# Altium schematic sheet MCU.SchDoc
size A4
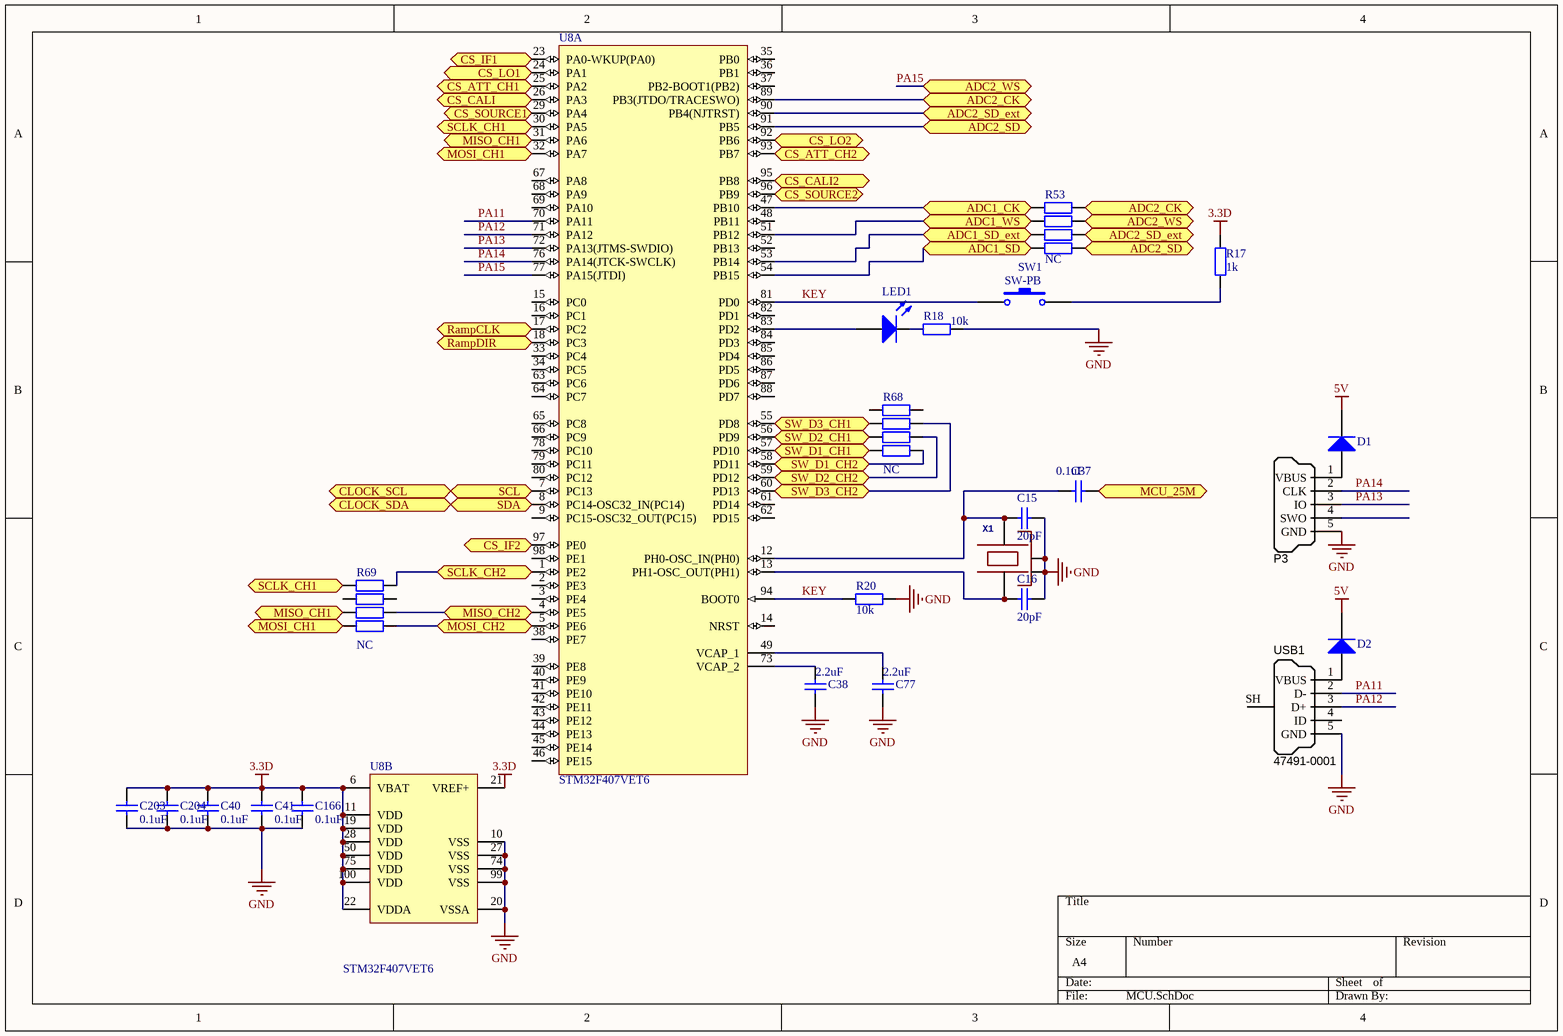
[diagram p0: MCU.SchDoc]

## Parts
C15  value 20pF  [0402]  (hidden comment: Cap)
C16  value 20pF  [0402]  (hidden comment: Cap)
C37  0.1uF  [0402]
C38  2.2uF  [0603]
C40  value 0.1uF  [0402]  (hidden comment: Cap)
C41  value 0.1uF  [0402]  (hidden comment: Cap)
C77  2.2uF  [0603]
C166  value 0.1uF  [0402]  (hidden comment: Cap)
C203  value 0.1uF  [0402]  (hidden comment: Cap)
C204  value 0.1uF  [0402]  (hidden comment: Cap)
D1  (no value)  [LC-SOD-323]
D2  (no value)  [LC-SOD-323]
LED1  LED0  [0603]  (value not drawn)
P3  SWD_MicroUSB  [MICRO-YZX]  (value not drawn)
R17  1k  [0402]
R18  10k  [0402]
R20  value 10k  [0402]  (hidden comment: Res2)
R53  NC  [0402X4]
R68  NC  [0402X4]
R69  NC  [0402X4]
SW1  SW-PB  [SW3x4]
U8  STM32F407VET6  [STM-LQFP100_N]  (parts A,B of 2)
USB1  Manufacturer Part Number 1: 47491-0001  [MICRO-YZX]  (hidden comment: USB Micro Type B)
X1  24.000 KHz 3.2x2.5mm 8-10pf  [OSCILLATOR-2.5x2.0]  (value not drawn)

## Ports
ADC1_CK, ADC1_SD, ADC1_SD_ext, ADC1_WS, ADC2_CK, ADC2_SD, ADC2_SD_ext, ADC2_WS, CLOCK_SCL, CLOCK_SDA, CS_ATT_CH1, CS_ATT_CH2, CS_CALI, CS_CALI2, CS_IF1, CS_IF2, CS_LO1, CS_LO2, CS_SOURCE1, CS_SOURCE2, MCU_25M, MISO_CH1, MISO_CH2, MOSI_CH1, MOSI_CH2, RampCLK, RampDIR, SCL, SCLK_CH1, SCLK_CH2, SDA, SW_D1_CH1, SW_D1_CH2, SW_D2_CH1, SW_D2_CH2, SW_D3_CH1, SW_D3_CH2

## Nets
3.3D: C40.2 C41.2 C166.2 C203.2 C204.2 R17.2 U8.6(VBAT) U8.11(VDD) U8.19(VDD) U8.21(VREF+) U8.22(VDDA) U8.28(VDD) U8.50(VDD) U8.75(VDD) U8.100(VDD)
5V: D1.2(K) D2.2(K)
GND: C15.1 C16.1 C38.1 C40.1 C41.1 C77.1 C166.1 C203.1 C204.1 P3.5(GND) R18.2 R20.2 U8.10(VSS) U8.20(VSSA) U8.27(VSS) U8.74(VSS) U8.99(VSS) USB1.5(GND) X1.2(NC_2) X1.4(NC_4)
ADC1_CK: R53.1 U8.47(PB10) ; port ADC1_CK
ADC1_SD: R53.4 U8.54(PB15) ; port ADC1_SD
ADC1_SD_ext: R53.3 U8.53(PB14) ; port ADC1_SD_ext
ADC1_WS: R53.2 U8.51(PB12) ; port ADC1_WS
ADC2_CK: R53.8 U8.89(PB3(JTDO/TRACESWO)) ; port ADC2_CK
ADC2_SD: R53.5 U8.91(PB5) ; port ADC2_SD
ADC2_SD_ext: R53.6 U8.90(PB4(NJTRST)) ; port ADC2_SD_ext
CLOCK_SCL: U8.7(PC13) ; port SCL, port CLOCK_SCL
CLOCK_SDA: U8.8(PC14-OSC32_IN(PC14)) ; port SDA, port CLOCK_SDA
CS_ATT_CH1: U8.25(PA2) ; port CS_ATT_CH1
CS_ATT_CH2: U8.93(PB7) ; port CS_ATT_CH2
CS_CALI: U8.26(PA3) ; port CS_CALI
CS_CALI2: U8.95(PB8) ; port CS_CALI2
CS_IF1: U8.23(PA0-WKUP(PA0)) ; port CS_IF1
CS_IF2: U8.97(PE0) ; port CS_IF2
CS_LO1: U8.24(PA1) ; port CS_LO1
CS_LO2: U8.92(PB6) ; port CS_LO2
CS_SOURCE1: U8.29(PA4) ; port CS_SOURCE1
CS_SOURCE2: U8.96(PB9) ; port CS_SOURCE2
KEY: R20.1 SW1.1 U8.81(PD0) U8.94(BOOT0)
MCU_25M: C37.2 ; port MCU_25M
MISO_CH1: R69.6 U8.31(PA6) ; port MISO_CH1
MISO_CH2: R69.3 U8.4(PE5) ; port MISO_CH2
MOSI_CH1: R69.5 U8.32(PA7) ; port MOSI_CH1
MOSI_CH2: R69.4 U8.5(PE6) ; port MOSI_CH2
PA11: U8.70(PA11) USB1.2(D-)
PA12: U8.71(PA12) USB1.3(D+)
PA13: P3.3(IO) U8.72(PA13(JTMS-SWDIO))
PA14: P3.2(CLK) U8.76(PA14(JTCK-SWCLK))
PA15: R53.7 U8.77(PA15(JTDI)) ; port ADC2_WS
RampCLK: U8.17(PC2) ; port RampCLK
RampDIR: U8.18(PC3) ; port RampDIR
SCLK_CH1: R69.8 U8.30(PA5) ; port SCLK_CH1
SCLK_CH2: R69.1 U8.1(PE2) ; port SCLK_CH2
SW_D1_CH1: R68.5 U8.57(PD10) ; port SW_D1_CH1
SW_D1_CH2: R68.4 U8.58(PD11) ; port SW_D1_CH2
SW_D2_CH1: R68.6 U8.56(PD9) ; port SW_D2_CH1
SW_D2_CH2: R68.3 U8.59(PD12) ; port SW_D2_CH2
SW_D3_CH1: R68.7 U8.55(PD8) ; port SW_D3_CH1
SW_D3_CH2: R68.2 U8.60(PD13) ; port SW_D3_CH2
NetC15_2: C15.2 C37.1 U8.12(PH0-OSC_IN(PH0)) X1.3
NetC16_2: C16.2 U8.13(PH1-OSC_OUT(PH1)) X1.1
NetC38_2: C38.2 U8.73(VCAP_2)
NetC77_2: C77.2 U8.49(VCAP_1)
NetD1_1: D1.1(A) P3.1(VBUS)
NetD2_1: D2.1(A) USB1.1(VBUS)
NetLED1_1: LED1.1(A) U8.83(PD2)
NetLED1_2: LED1.2(K) R18.1
NetR17_1: R17.1 SW1.2

Not connected (* = marked no-connect by the designer): P3 4(SWO); R68 1 8; R69 2 7; U8 2(PE3) 3(PE4) 9(PC15-OSC32_OUT(PC15)) 14(NRST) 15(PC0) 16(PC1) 33(PC4) 34(PC5) 35(PB0) 36(PB1) 37(PB2-BOOT1(PB2)) 38(PE7) 39(PE8) 40(PE9) 41(PE10) 42(PE11) 43(PE12) 44(PE13) 45(PE14) 46(PE15) 48(PB11) 52(PB13) 61(PD14) 62(PD15) 63(PC6) 64(PC7) 65(PC8) 66(PC9) 67(PA8) 68(PA9) 69(PA10) 78(PC10) 79(PC11) 80(PC12) 82(PD1) 84(PD3) 85(PD4) 86(PD5) 87(PD6) 88(PD7) 98(PE1); USB1 4(ID) SH(Shell)

## Library data of the parts
C15 C16 C37 C38 C40 C41 C77 C166 C203 C204 = Cap: Capacitor
  C15 C16 C40 C41 C166 C203 C204: Published: 8-Jun-2000; LatestRevisionDate: 17-Jul-2002; LatestRevisionNote: Re-released for DXP Platform.; PackageReference: RAD-0.3; Publisher: Altium Limited; PackageDescription: Radial Cap, Thru-Hole; 2 Leads; 0.3 in Pin Spacing
D1 D2 = Diode 1N4148: High Conductance Fast Diode; Published: 8-Jun-2000; LatestRevisionDate: 17-Jul-2002; LatestRevisionNote: Re-released for DXP Platform.; DatasheetVersion: 1997; PackageReference: DO-35; Publisher: Altium Limited; PackageDescription: Diode, Axial; Body 3.8 x 1.9 mm (LxDia. max), Lead Dia. 0.53 mm (max); Code_JEDEC: DO-204-AH; ComponentLink1Description: Manufacturer Link; ComponentLink1URL: http://www.fairchildsemi.com/; ComponentLink2Description: Datasheet; ComponentLink2URL: http://www.fairchildsemi.com/ds/1N%2F1N4148.pdf
LED1 = LED0: Typical INFRARED GaAs LED; Published: 8-Jun-2000; LatestRevisionDate: 08-Jul-2005; LatestRevisionNote: Mech Layer 1 removed.; PackageReference: LED-0; Publisher: Altium Limited; PackageDescription: LED; 2 Leads
P3 = SWD_MicroUSB: Connector SMD USB Micro Type B middle mount; Manufacturer 1: Molex Inc; SCDType: undef; Package / Case: SMD; Supplier 1: Digi-Key; Supplier Part Number 1: WM17142CT-ND
R17 R18 = Res2: Resistor; Value: 0Ohm; Published: 8-Jun-2000; LatestRevisionDate: 17-Jul-2002; LatestRevisionNote: Re-released for DXP Platform.; PackageReference: AXIAL-0.4; Publisher: Altium Limited; PackageDescription: Axial Device, Thru-Hole; 2 Leads; 0.4 in Pin Spacing
R20 = Res2: Resistor; Published: 8-Jun-2000; LatestRevisionDate: 17-Jul-2002; LatestRevisionNote: Re-released for DXP Platform.; PackageReference: AXIAL-0.4; Publisher: Altium Limited; PackageDescription: Axial Device, Thru-Hole; 2 Leads; 0.4 in Pin Spacing
R53 R68 R69 = Res*4: Resistor; Published: 8-Jun-2000; LatestRevisionDate: 17-Jul-2002; LatestRevisionNote: Re-released for DXP Platform.; PackageReference: AXIAL-0.4; Publisher: Altium Limited; PackageDescription: Axial Device, Thru-Hole; 2 Leads; 0.4 in Pin Spacing
SW1 = SW-PB: Switch; Published: 24-Mar-1999; LatestRevisionDate: 17-Jul-2002; LatestRevisionNote: Re-released for DXP Platform.; PackageReference: SPST-2; Publisher: Altium Limited; PackageDescription: Switch; 2 Leads
U8 = STM32F407VET6: ARM Cortex-M4 32-bit MCU+FPU, 210 DMIPS, 512 kB Flash, 192 kB Internal RAM, 82 I/Os, 100-pin LQFP, -40 to 85 degC, Tray; Manufacturer: STMicroelectronics; D/A Converter: 2x12-bit; FLASH Size (Prog) (kB): 512; I/Os (High Current): 82; Internal RAM Size (kB): 192; Operating Frequency(F) (Processor speed) (MHz): 168; Supply Voltage(Vcc) max (V): 3.6; Supply Voltage(Vcc) min (V): 1.8; DatasheetVersion: Rev. 4; PackageVersion: Rev. 1, 06/2013; PackageReference: LQFP100; PackageDescription: 100-Pin Low Profile Quad Flat Package, 14 x 14 mm Body, 0.5 mm Pitch; Supplier 1: Digi-Key; Supplier Part Number 1: 497-12075-ND; Supplier 2: Farnell; Supplier Part Number 2: 2064367; Supplier 3: Newark; Supplier Part Number 3: 73T2332; Supplier 4: Mouser; Supplier Part Number 4: 511-STM32F407VET6; Core: ARM Cortex-M4; Packing: Tray; Mounting Technology: Surface Mount; PartNumber: STM32F407VET6; ComponentLink1Description: Manufacturer URL; ComponentLink1URL: http://www.st.com/web/en/home.html; ComponentLink2Description: Datasheet; ComponentLink2URL: http://www.st.com/st-web-ui/static/active/en/resource/technical/document/datasheet/DM00037051.pdf; ComponentLink3Description: Package Specification; ComponentLink3URL: http://www.st.com/st-web-ui/static/active/en/resource/technical/document/data_brief/DM00071938.pdf
USB1 = USB_Micro_TypeB: Connector SMD USB Micro Type B middle mount; Manufacturer 1: Molex Inc; SCDType: undef; Package / Case: SMD; Supplier 1: Digi-Key; Supplier Part Number 1: WM17142CT-ND
X1 = OSCILLATOR-3.2X2.5: Crystal Oscillator in 3.2x2.5 SMD